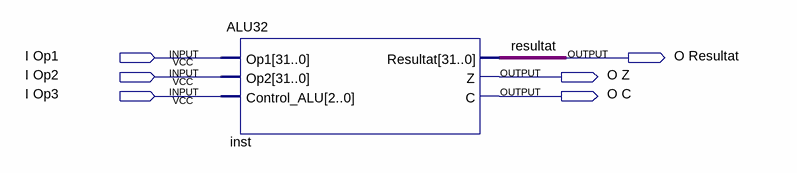
[diagram p0: schematic sheet]
// Quartus schematic SymbolALU32.bdf as structural Verilog: 1 symbols, 6 pins
module SymbolALU32 (
  input  \I_Op1 ,
  input  \I_Op2 ,
  input  \I_Op3 ,
  output \O_Resultat ,
  output \O_Z ,
  output \O_C 
);

  ALU32 inst (
    .Op1({32{\I_Op1 }}), .Op2({32{\I_Op2 }}), .Control_ALU({3{\I_Op3 }}), .Resultat(\O_Resultat ), .Z(\O_Z ),
    .C(\O_C ));

  // Other names for the same wires on the sheet: resultat = \O_Resultat 
endmodule
